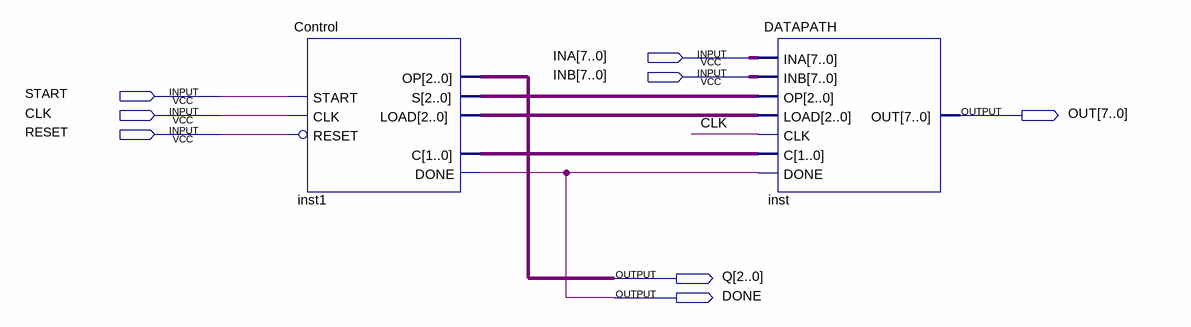
[diagram p0: schematic sheet]
// Quartus schematic CHAPTER3_2_2.bdf as structural Verilog: 2 symbols, 8 pins
module CHAPTER3_2_2 (
  input  [7:0] INA,
  input  [7:0] INB,
  input  START,
  input  CLK,
  input  RESET,
  output [7:0] OUT,
  output [2:0] Q,
  output DONE
);

  wire [1:0] inst1_c;
  wire [2:0] inst1_load, inst1_s;

  Control inst1 (
    .CLK(CLK), .RESET(~RESET), .START(START), .C(inst1_c), .DONE(DONE), .LOAD(inst1_load), .OP(Q), .S(inst1_s));
  DATAPATH inst (.INA(INA), .INB(INB), .OP(inst1_s), .LOAD(inst1_load), .CLK(CLK), .C(inst1_c), .DONE(DONE), .OUT(OUT));
endmodule
